# EAGLE design Adafruit OV5640 Breakout (EAGLE 9.6.2)
COMPANY: ADAFRUIT INDUSTRIES; DRAWN: KTOWN; REV: A
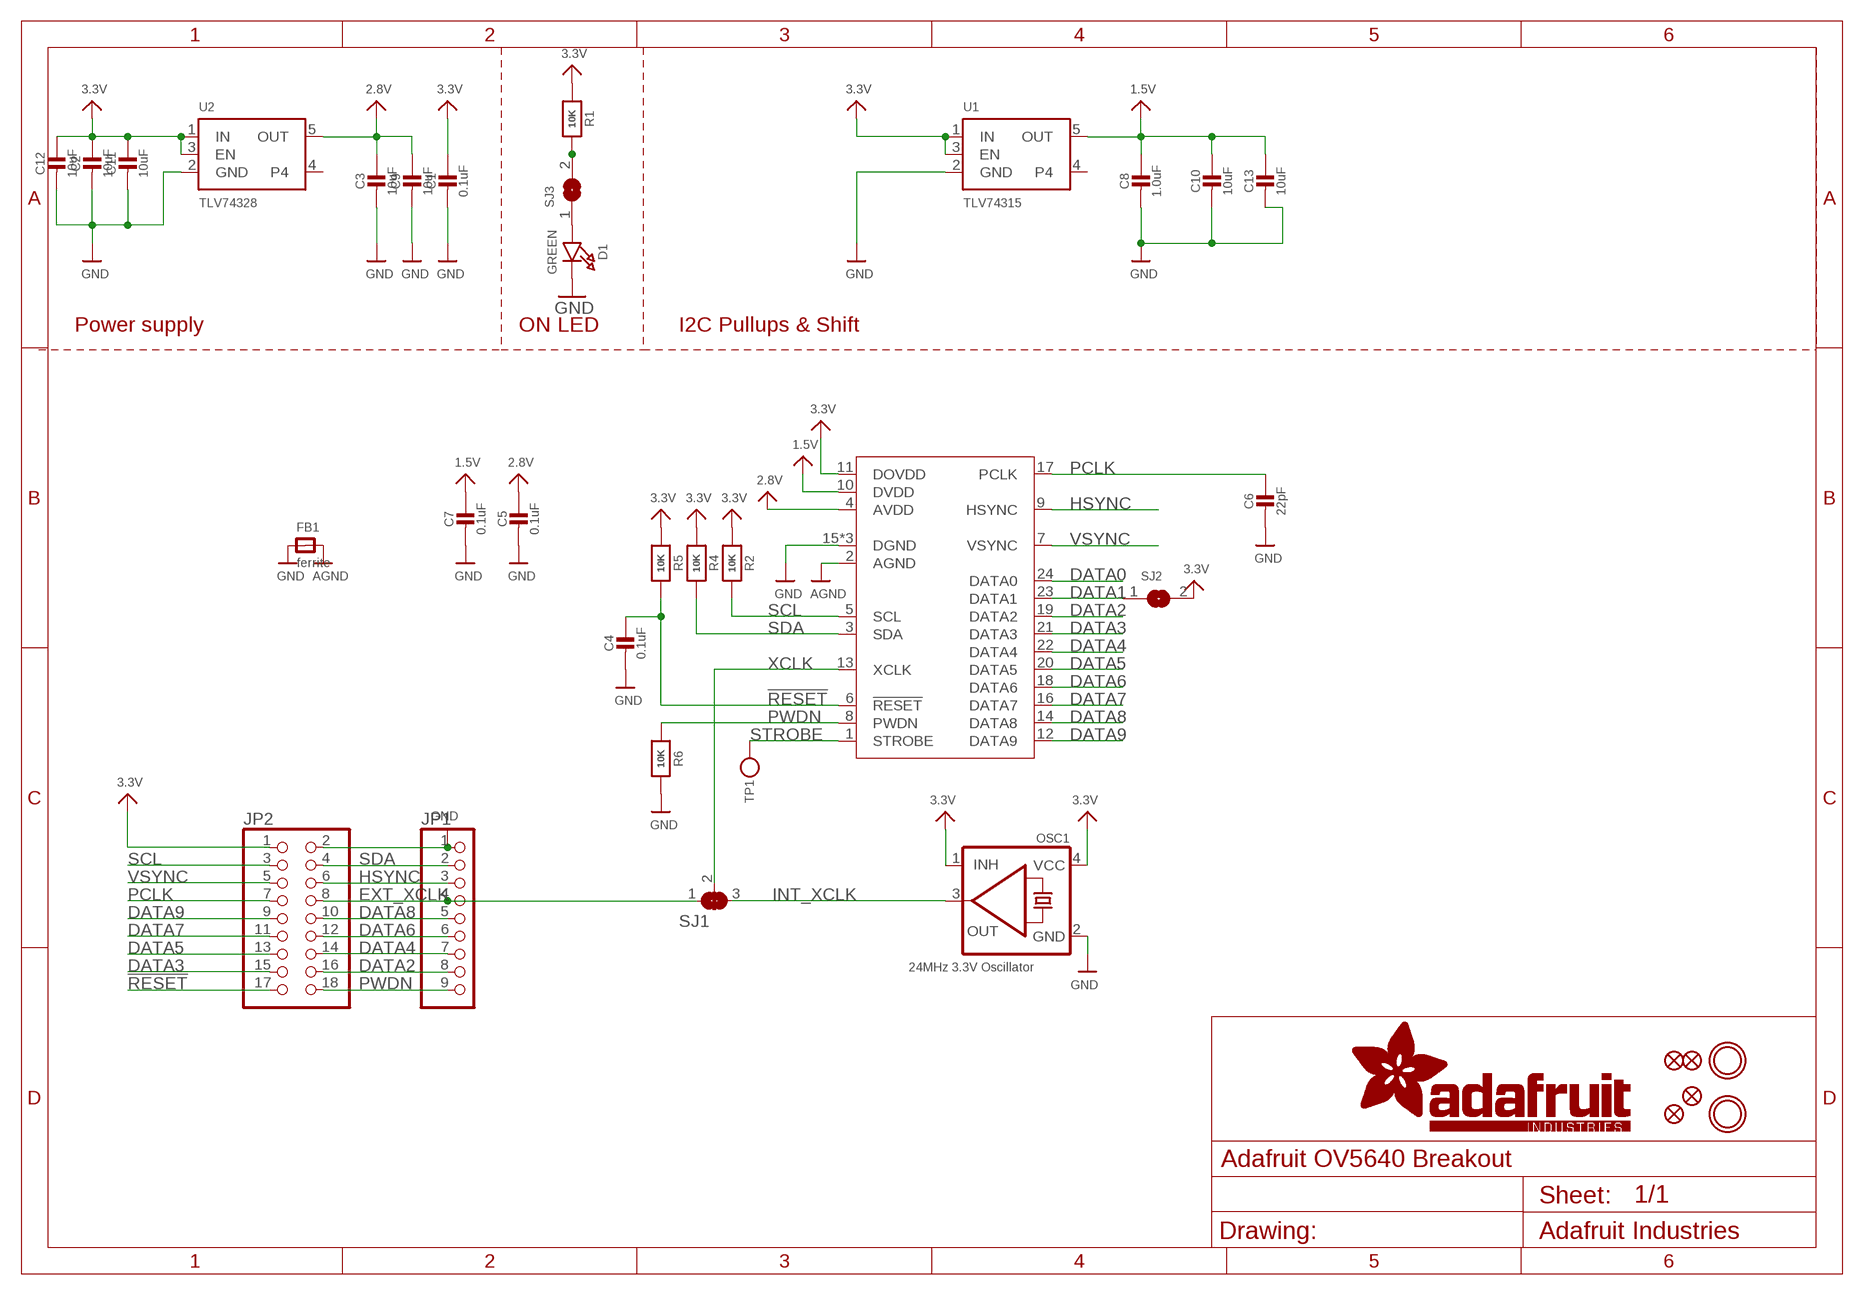
[diagram p0: schematic, sheet 1]

## Parts
C1  0.1uF  CAP_CERAMIC0603_NO  [0603-NO]
C2  10uF  CAP_CERAMIC0805-NOOUTLINE  [0805-NO]
C3  10uF  CAP_CERAMIC0805-NOOUTLINE  [0805-NO]
C4  0.1uF  CAP_CERAMIC0603_NO  [0603-NO]
C5  0.1uF  CAP_CERAMIC0603_NO  [0603-NO]
C6  22pF  CAP_CERAMIC0603_NO  [0603-NO]
C7  0.1uF  CAP_CERAMIC0603_NO  [0603-NO]
C8  1.0uF  CAP_CERAMIC0603_NO  [0603-NO]
C9  10uF  CAP_CERAMIC0805-NOOUTLINE  [0805-NO]
C10  10uF  CAP_CERAMIC0805-NOOUTLINE  [0805-NO]
C11  10uF  CAP_CERAMIC0805-NOOUTLINE  [0805-NO]
C12  10uF  CAP_CERAMIC0805-NOOUTLINE  [0805-NO]
C13  10uF  CAP_CERAMIC0805-NOOUTLINE  [0805-NO]
D1  GREEN  LED0603_NOOUTLINE  [CHIPLED_0603_NOOUTLINE]
FB1  ferrite  FERRITE-0603NO  [0603-NO]
FID1  FIDUCIAL_1MM  [FIDUCIAL_1MM]
FID2  FIDUCIAL_1MM  [FIDUCIAL_1MM]
FID3  FIDUCIAL_1MM  [FIDUCIAL_1MM]
FID4  FIDUCIAL_1MM  [FIDUCIAL_1MM]
JP1  HEADER-1X970MIL  [1X09_ROUND_70]
JP2  PINHD-2X9-BIG  [2X09-BIG]
OSC1  24MHz 3.3V Oscillator  OSCILLATOR3.2X2.5  [OSC_3.2X2.5MM]
R1  10K  RESISTOR_0603_NOOUT  [0603-NO]
R2  10K  RESISTOR_0603_NOOUT  [0603-NO]
R4  10K  RESISTOR_0603_NOOUT  [0603-NO]
R5  10K  RESISTOR_0603_NOOUT  [0603-NO]
R6  10K  RESISTOR_0603_NOOUT  [0603-NO]
SJ1  SOLDERJUMPER_2WAY  [SOLDERJUMPER_2WAY_OPEN_NOPASTE]
SJ2  SOLDERJUMPER  [SOLDERJUMPER_ARROW_NOPASTE]
SJ3  SOLDERJUMPERCLOSED  [SOLDERJUMPER_CLOSEDWIRE]
TP1  TESTPOINTROUND1.5MM  [TESTPOINT_ROUND_1.5MM]
U1  TLV74315  VREG_SOT23-5  [SOT23-5]
U2  TLV74328  VREG_SOT23-5  [SOT23-5]
U$1  MOUNTINGHOLE3.0THIN  [MOUNTINGHOLE_3.0_PLATEDTHIN]
U$17  MOUNTINGHOLE3.0THIN  [MOUNTINGHOLE_3.0_PLATEDTHIN]
X1  CAMERA_OV2640  [OV2640FSL]

## Nets
1.5V: C7.1 C8.1 C10.1 C13.1 U1.5(OUT) X1.10(DVDD)
2.8V: C3.1 C5.1 C9.1 U2.5(OUT) X1.4(AVDD)
3.3V [lowpower]: C1.1 C2.1 C11.1 C12.1 JP2.1 OSC1.1(INH) OSC1.4(VCC) R1.1 R2.1 R4.1 R5.1 SJ2.2 U1.1(IN) U1.3(EN) U2.1(IN) U2.3(EN) X1.11(DOVDD)
!RESET: C4.1 JP2.17 R5.2 X1.6(!RESET)
AGND: FB1.2 X1.2(AGND)
DATA0: X1.24(DATA0)
DATA1: SJ2.1 X1.23(DATA1)
DATA2: JP1.8 JP2.16 X1.19(DATA2)
DATA3: JP2.15 X1.21(DATA3)
DATA4: JP1.7 JP2.14 X1.22(DATA4)
DATA5: JP2.13 X1.20(DATA5)
DATA6: JP1.6 JP2.12 X1.18(DATA6)
DATA7: JP2.11 X1.16(DATA7)
DATA8: JP1.5 JP2.10 X1.14(DATA8)
DATA9: JP2.9 X1.12(DATA9)
EXT_XCLK: JP1.4 JP2.8 SJ1.1
GND [highpower]: C1.2 C2.2 C3.2 C4.2 C5.2 C6.2 C7.2 C8.2 C9.2 C10.2 C11.2 C12.2 C13.2 D1.C FB1.1 JP1.1 JP2.2 OSC1.2(GND) R6.2 U1.2(GND) U2.2(GND) X1.15(DGND) X1.SPRT1(DGND) X1.SPRT2(DGND)
HSYNC: JP1.3 JP2.6 X1.9(HSYNC)
INT_XCLK: OSC1.3(OUT) SJ1.3
N$1: R1.2 SJ3.2
N$3: D1.A SJ3.1
PCLK: C6.1 JP2.7 X1.17(PCLK)
PWDN: JP1.9 JP2.18 R6.1 X1.8(PWDN)
SCL: JP2.3 R2.2 X1.5(SCL)
SDA: JP1.2 JP2.4 R4.2 X1.3(SDA)
STROBE: TP1.P$1 X1.1(STROBE)
VSYNC: JP2.5 X1.7(VSYNC)
XCLK: SJ1.2 X1.13(XCLK)
Unconnected: U1.4 U2.4

## Notes on the sheet
- Power supply | ON LED | I2C Pullups & Shift

## Library data of the parts
C1-C13 = microbuilder:CAP_CERAMIC: Ceramic Capacitors For new designs, use the packages preceded by an '_' character since they are more reliable: The following footprints should be used on most boards: _0402 - Standard footprint for regular board layouts _0603 - Standard footprint for regular board layouts _0805 - Standard footprint for regular board layouts _1206 - Standard footprint for regular board layouts For extremely tight-pitch boards where space is at a premium, the following 'micro-pitch' footprints can be used (smaller pads, no silkscreen outline, etc.): _0402MP - Micro-pitch footprint for very dense/compact boards _0603MP - Micro-pitch footprint for very dense/compact boards _0805MP - Micro-pitch footprint for very dense/compact boards _1206MP - Micro-pitch footprint for very dense/compact boards
D1 = microbuilder:LED: LED 0603 - 0603 Surface Mount Package 2mA: Green LED - Low Power (3.9mcd, 2ma, 1.7Vf) - Digikey: 475-2709-2-ND Orange LED - Low Power (9.8mcd, 2ma, 1.8Vf) - Digikey: 475-1194-2-ND Red LED - Low Power (5mcd, 2ma, 1.8Vf) - Digikey: 475-1195-2-ND Yellow LED - Low Power (7mcd, 2ma, 1.8Vf) - Digikey: 475-1196-2-ND 5mA: Blue LED - Low Power (17mcd, 5ma, 2.9Vf) - Digikey: LNJ937W8CRACT-ND 0805 - 0805 Surface Mount Package 2mA: Red LED (8.8mcd, 2mA, 1.8Vf, Clear) - Low Power [Digikey: 475-2510-1-ND] Green LED (5mcd, 2mA, 1.8Vf, Clear) - Low Power [Digikey: 475-2730-1-ND] Yellow LED (11.3mcd, 2mA, 1.8Vf, Clear) - Low Power [Digikey: 475-2555-1-ND] 20mA: Red LED (104mcd, 20mA, Diffused) - LS R976 [Digikey: 475-1278-6-ND] Red LED (12mcd, 20mA, 2.0Vf, Clear) - APT2012EC [Digikey: 754-1128-1-ND] Green LED (15mcd, 20mA, 2.2Vf, Clear) - APT2012GC [Digikey: 754-1131-1-ND] Orange LED (160mcd, 20mA, 2.1Vf, Clear) - APT2012SECK [Digikey: 754-1130-1-ND] 1206 - 1206 Surface Mount Package Green LED (26mcd, 20mA, Diffused) - LG N971 [Digikey: 475-1407-6-ND] Red LED (15mcd, 20mA, Diffused) - LH N974 [Digikey: 475-1416-6-ND] Cree - Cree High-Power Surface Mount LEDs XPEBWT-L1-0000-00D50 - White 111lm 350mA 2.9Vf 6200K 110° XTEAWT-00-0000-00000LEE3 - White 114lm 350mA 2.85Vf 5000K 115° Everlight - Everlight 45-21 Series Surface Mount LEDs 45-21/QK2C-B2832AC2CB2/2T - Warm White 2000mcd 20mA 3.25Vf 3050K 120° 45-21/LK2C-B38452C4CB2/2T - Nuetral White 2000mcd 20mA 3.25Vf 4150K 120° 45-21/LK2C-B50634C6CB2/2T - Cold White 2200mcd 20mA 3.25Vf 5650K 120° PLCC2 Reverse Mount LS T77K-J1L2-1-0-2-R18-Z - Red 11.25mcd 2mA 1.8Vf 630nm 120° LO T77K-L1M2-24-Z - Orange 19.6mcd 2mA 1.8Vf 606nm 120° LY T77K-K2M1-26-Z - Yellow 15.7mcd 2mA 1.8Vf 587nm 120°; ROT: 270
FB1 = microbuilder:FERRITE: Ferrite Bead 0603 MMZ1608B121C - 120 Ohm @ 100MHz, 600mA, 0.15 Ohm DC Resistance - Digikey: 445-2164-1-ND BK1608HW121-T - 120 Ohm, 600mA Ferrite Chip - Digikey: 587-1876-2-ND 0805 HZ0805B272R-10 - 2.7K Ohm @ 100MHz, 200mA, 0.8 Ohm DC Resistance - Digikey: 240-2504-1-ND (see also Murata BLM21BD272SN1L) MMZ2012Y152B - 1.5K Ohm @ 100MHz, 500mA, 0.4 Ohm DC Resistance - Digikey: 445-1560-1-ND - Mainly for high frequency (80-400MHz) MMZ2012R102A - 1K Ohm @ 100MHz, 500mA, 0.3 Ohm DC Resistance - Digikey: 445-1555-2-ND - More general purpose (10-200MHz)
FID1-FID4 = microbuilder:FIDUCIAL: Fiducial Alignment Points Various fiducial points for machine vision alignment.; BOM: EXCLUDE
JP1 = microbuilder:HEADER-1X9: PIN HEADER
JP2 = adafruit:PINHD-2X9: PIN HEADER With larger annulars
OSC1 = microbuilder:OSCILLATOR: Oscillators 3.2x2.5mm SMT 4.0MHz +/- 50ppm, 3.3V, 9mA, -40/+85°C - Digikey: 535-9752-1-ND 50MHz +/- 50ppm, 3.3V, 8mA, -10/+70°C - Digikey: 478-4792-1-ND 5x7mm SMT 4.0MHz +/-20ppm 3.3V, 20mA, -20/+70°C - Digikey: 535-9329-2-ND 50MHz +/- 25ppm 3.3V, 35mA, -40/+85°C - Digikey: 631-1197-1-ND
R1 R2 R4-R6 = microbuilder:RESISTOR: Resistors For new designs, use the packages preceded by an '_' character since they are more reliable: The following footprints should be used on most boards: _0402 - Standard footprint for regular board layouts _0603 - Standard footprint for regular board layouts _0805 - Standard footprint for regular board layouts _1206 - Standard footprint for regular board layouts For extremely tight-pitch boards where space is at a premium, the following 'micro-pitch' footprints can be used (smaller pads, no silkscreen outline, etc.): _0402MP - Micro-pitch footprint for very dense/compact boards _0603MP - Micro-pitch footprint for very dense/compact boards _0805MP - Micro-pitch footprint for very dense/compact boards _1206MP - Micro-pitch footprint for very dense/compact boards
SJ1 = microbuilder:SOLDERJUMPER_2WAY: 2-Way Solder Jumper
SJ2 = microbuilder:SOLDERJUMPER: SMD Solder JUMPER Solder the two pads together to create a connection, or remove the solder to break it. REFLOW - Use this footprint for solder paste and reflow ovens. WAVE - Use this footprint for hand-soldering (larger pads). CLOSED - Has a trace between the two pads to ensure it is closed by default. The trace needs to be cut to disable the jumper, and can be closed again by creating a solder bridge between the two pads.; BOM: EXCLUDE
SJ3 = microbuilder:SOLDERJUMPER: SMD Solder JUMPER Solder the two pads together to create a connection, or remove the solder to break it. REFLOW - Use this footprint for solder paste and reflow ovens. WAVE - Use this footprint for hand-soldering (larger pads). CLOSED - Has a trace between the two pads to ensure it is closed by default. The trace needs to be cut to disable the jumper, and can be closed again by creating a solder bridge between the two pads.
TP1 = microbuilder:TESTPOINT: Test Point Various test points for characterisation and PCB testing TESTPOINT_SMT - Compact Surface Mount Test Point [Digikey: 5016KTR-ND]
U1 U2 = adafruit_power:VREG_SOT23-5: SOT23-5 Fixed Voltage Regulators Part Current Out V Out V In V Dropout θJA (°C/W) TJ (°C) Digikey Part No. ADP121 150mA 3.3V 3.4-5.5V 0.09V @ 150mA -- -- ADP121-AUJZ33R7CT-ND ADP121 150mA 3.0V 3.1-5.5V 0.09V @ 150mA -- -- ADP121-AUJZ30R7CT-ND ADP122 300mA 3.3V 3.4-5.5V 0.085V @ 300mA -- -- ADP122AUJZ-3.3-R7CT-ND ADP1712 300mA 3.3V 3.5-5.5V 0.17V @ 300mA -- -- ADP1712AUJZ-3.3-R7TR-ND AP7311 (Low Cost) 150mA 3.3V 3.5-6V 0.15V @ 150mA -- -- AP7311-33WG-7DICT-ND LD39015M18R 150mA 1.8V 1.9V-5.5V 0.08V @ 100mA -- -- 497-6977-1-ND LP2985A-33DBVR 150mA 3.3V 3.3-16V 0.28V @ 150mA 206 150 296-18479-1-ND MCP1824T-3302E/OT 300mA 3.3V 3.5V-6V 0.2V @ 300mA -- -- MCP1824T-3302E/OTCT-ND MIC5205-2.5YM5 TR 150mA 2.5V 2.7-16V 0.165V @ 150mA -- -- 576-1257-2-ND MIC5205-3.0YM5 TR 150mA 3.0V 3.2V-16V 0.165V @ 150mA -- -- 576-1258-2-ND MIC5205-3.3YM5 TR 150mA 3.3V 3.5V-16V 0.165V @ 150mA -- -- 576-1259-2-ND TPS780330220 150mA 3.3V+2.2V 3.6-5.5V 250mV Max -- -- 296-23332-1-ND TDA3663/N1,135 100mA 3.3V 3.5-45V 0.18V @ 50mA -- -- 568-5343-1-ND Max operating temp can be calculated using θJA, TJ (max junction temperature), and power in watts. Set the "Maximum Ambient Temperature" until it reaches TJ ("Max Junction Temperature"), which is the absolute limit for safe use of the regulator: Heat Sink Temperature Calculator <http://www.daycounter.com/Calculators/Heat-Sink-Temperature-Calculator.phtml> For example, With 12V source into a 3.3V LP2985 and a 30mA load, we are dissipating (12V-3.3V) * 0.03A = 0.261W. With a θJA of 206 °C/W, a TJ of 150°C, and 261mW we can safely use the chip without a heat sink up to 75°C (=147.1°C Junction Temperature).; JLC_ROTATION: 0
U$1 U$17 = adafruit_electromech:MOUNTINGHOLE: Mounting Hole For #2 screws (0.086"/2.18mm width, 0.094"/2.4mm hole) use 2.5mm; BOM: EXCLUDE
X1 = adafruit_sensor:CAMERA_OV2640

## Net classes
1 highpower: width 0.305 mm, drill 0.483 mm
2 lowpower: width 0.254 mm, drill 0.483 mm

## Board
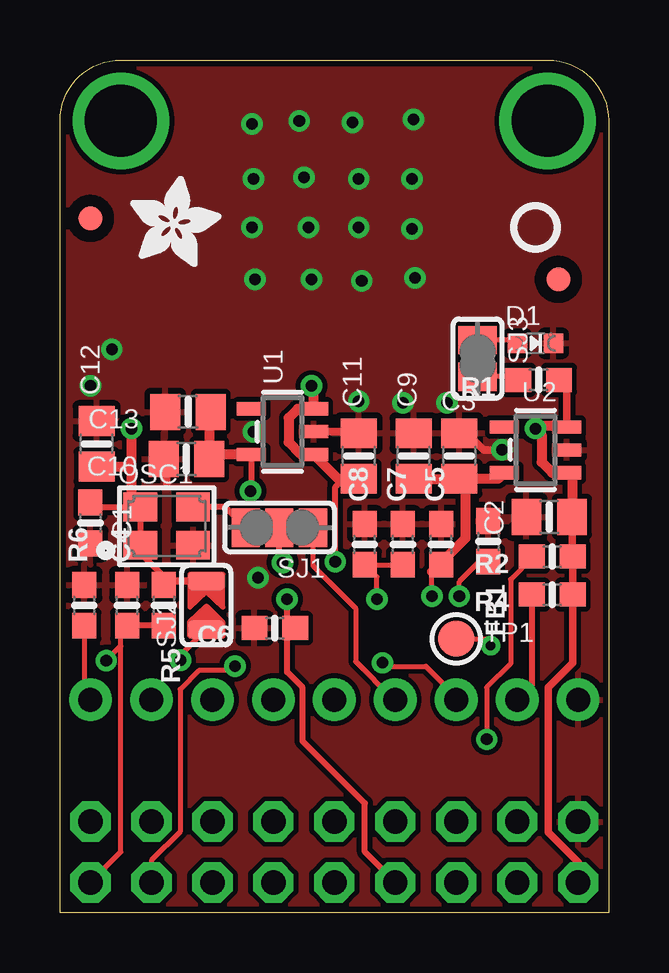
[diagram p1: board, top side]
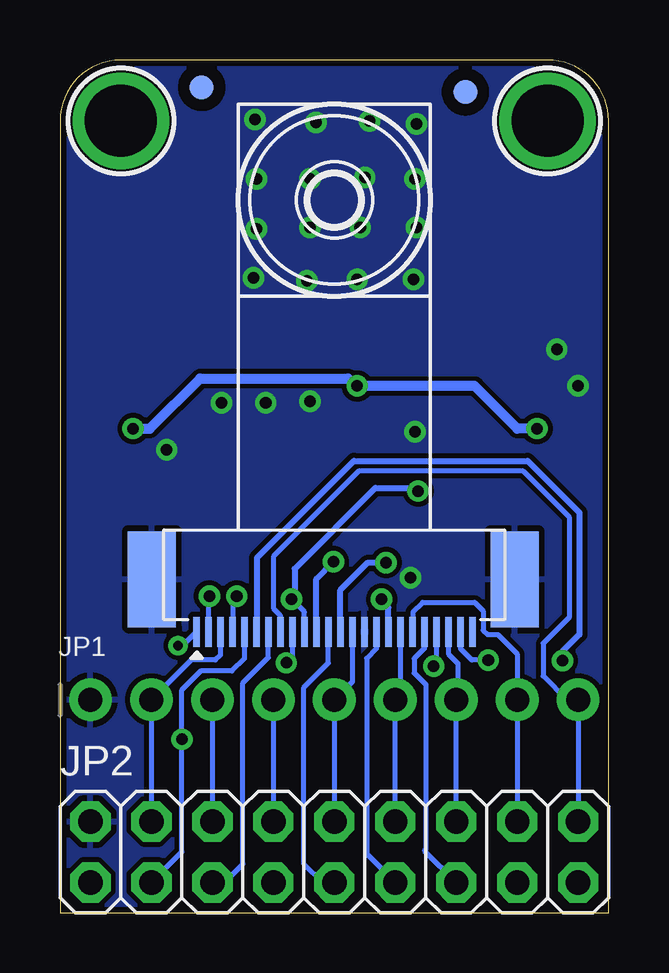
[diagram p2: board, bottom side, seen from below]

Size 22.86 x 35.56 mm. Coordinates in mm from the lower left corner, seen from the top.
Outline: 0,0 0,33.02 arc-90 2.54,35.56 20.32,35.56 arc-90 22.86,33.02 22.86,0 0,0
Copper layers (1*16): Top 0.035mm / dielectric 1.5mm / Bottom 0.035mm
Design rules "adafruit *": minimum track width 8mil, minimum drill 15.5mil, track to track 8mil, track to pad 8mil, pad to pad 8mil, via to via 8mil, smd to smd 8mil, copper to edge 10mil, drill to drill 8mil, minimum pad ring 10mil, minimum via ring 8mil, stop-mask expansion 2mil, vias tented up to drill 20mil, thermal gap 10mil

### Footprints (pad centres in the part's own frame; a part is rotated, then mirrored left to right if it is on the bottom)
0603-NO = smd 1.075 x 1: 1 -0.85,0; 2 0.85,0
0805-NO = smd 1.24 x 1.5: 1 -0.95,0; 2 0.95,0
CHIPLED_0603_NOOUTLINE = smd 0.8 x 0.8: A 0,-0.75; C 0,0.75
FIDUCIAL_1MM = smd 1 x 1: 1 0,0
1X09_ROUND_70 = drill 1 pad 1.778: 1 -10.16,0; 2 -7.62,0; 3 -5.08,0; 4 -2.54,0; 5 0,0; 6 2.54,0; 7 5.08,0; 8 7.62,0; 9 10.16,0
2X09-BIG = drill 1.016 pad 1.676 octagon: 1 -10.16,-1.27; 2 -10.16,1.27; 3 -7.62,-1.27; 4 -7.62,1.27; 5 -5.08,-1.27; 6 -5.08,1.27; 7 -2.54,-1.27; 8 -2.54,1.27; 9 0,-1.27; 10 0,1.27; 11 2.54,-1.27; 12 2.54,1.27; 13 5.08,-1.27; 14 5.08,1.27; 15 7.62,-1.27; 16 7.62,1.27; 17 10.16,-1.27; 18 10.16,1.27
OSC_3.2X2.5MM = smd 1.4 x 1.2: 1 -1.1,-0.8; 2 1.1,-0.8; 3 1.1,0.8; 4 -1.1,0.8
SOLDERJUMPER_2WAY_OPEN_NOPASTE = smd 1.168 x 1.6: 1 -1.397,0; 2 0,0; 3 1.397,0
SOLDERJUMPER_ARROW_NOPASTE = smd 0.762 x 1.524: 1 -1.016,0; 2 1.016,0
SOLDERJUMPER_CLOSEDWIRE = smd 1.168 x 1.6: 1 -0.762,0; 2 0.762,0 | smd 0.635 x 0.203: WIRE 0,0
TESTPOINT_ROUND_1.5MM = smd 1.5 x 1.5: P$1 0,0
SOT23-5 = smd 0.55 x 1.2: 1 -0.95,-1.3; 2 0,-1.3; 3 0.95,-1.3; 4 0.95,1.3; 5 -0.95,1.3
MOUNTINGHOLE_3.0_PLATEDTHIN = drill 3 pad 3.6: P$1 0,0
OV2640FSL = smd 0.275 x 1.25: 1 5.75,0.98; 2 5.25,0.98; 3 4.75,0.98; 4 4.25,0.98; 5 3.75,0.98; 6 3.25,0.98; 7 2.75,0.98; 8 2.25,0.98; 9 1.75,0.98; 10 1.25,0.98; 11 0.75,0.98; 12 0.25,0.98; 13 -0.25,0.98; 14 -0.75,0.98; 15 -1.25,0.98; 16 -1.75,0.98; 17 -2.25,0.98; 18 -2.75,0.98; 19 -3.25,0.98; 20 -3.75,0.98; 21 -4.25,0.98; 22 -4.75,0.98; 23 -5.25,0.98; 24 -5.75,0.98 | smd 2 x 4: SPRT1 7.6,-1.21; SPRT2 -7.51,-1.21

### Placement (x,y rotation side)
C1  1.27,16.26 270 top
C2  20.38,16.51 180 top
C3  16.64,19.05 90 top
C4  2.79,12.83 90 top
C5  15.88,15.37 90 top
C6  8.95,11.87 180 top
C7  14.29,15.37 90 top
C8  12.7,15.37 90 top
C9  14.73,19.05 90 top
C10  5.27,18.92 180 top
C11  12.45,19.05 90 top
C12  1.52,19.56 90 top
C13  5.33,20.89 180 top
D1  19.81,23.75 270 top
FB1  17.84,15.49 270 top
FID1  1.27,28.96 0 top
FID2  20.76,26.42 0 top
FID3  16.95,34.42 0 bottom
FID4  5.97,34.23 0 bottom
JP1  11.43,8.89 0 bottom
JP2  11.43,2.54 0 bottom
OSC1  4.45,16.13 0 top
PLABEL0  [PLABEL0]  18.99,24.38 0 top
PLABEL1  [PLABEL1]  10.48,13.78 90 top
PLABEL2  [PLABEL2]  7.87,13.91 90 top
PLABEL3  [PLABEL3]  9.14,17.72 0 top
PLABEL4  [PLABEL4]  6.16,10.48 0 top
PLABEL5  [PLABEL5]  16.07,21.78 90 top
PLABEL6  [PLABEL6]  19.68,22.92 90 bottom
PLABEL7  [PLABEL7]  3.68,23.37 90 bottom
PLABEL8  [PLABEL8]  1.08,7.24 0 bottom
PLABEL9  [PLABEL9]  3.68,7.37 0 bottom
PLABEL10  [PLABEL10]  6.22,7.37 0 bottom
PLABEL11  [PLABEL11]  8.76,7.37 0 bottom
PLABEL12  [PLABEL12]  11.3,7.37 0 bottom
PLABEL13  [PLABEL13]  13.84,7.37 0 bottom
PLABEL14  [PLABEL14]  16.38,7.37 0 bottom
PLABEL15  [PLABEL15]  18.92,7.37 0 bottom
PLABEL16  [PLABEL16]  21.46,7.37 0 bottom
PLABEL17  [PLABEL17]  21.46,5.84 0 bottom
PLABEL18  [PLABEL18]  18.92,5.84 0 bottom
PLABEL19  [PLABEL19]  16.38,5.84 0 bottom
PLABEL20  [PLABEL20]  13.84,5.84 0 bottom
PLABEL21  [PLABEL21]  11.3,5.84 0 bottom
PLABEL22  [PLABEL22]  8.76,5.84 0 bottom
PLABEL23  [PLABEL23]  6.22,5.84 0 bottom
PLABEL24  [PLABEL24]  3.68,5.84 0 bottom
PLABEL25  [PLABEL25]  1.14,5.84 0 bottom
R1  19.94,22.23 180 top
R2  20.51,14.86 180 top
R4  20.51,13.27 180 top
R5  4.32,12.83 270 top
R6  1.02,12.83 90 top
SJ1  9.14,16.07 180 top
SJ2  6.1,12.83 90 top
SJ3  17.4,23.11 270 top
TP1  16.51,11.43 0 top
U1  9.27,20.07 90 top
U2  19.81,19.3 90 top
U$1  20.32,33.02 0 bottom
U$17  2.54,33.02 0 bottom
U$22  [ADAFRUIT_3.5MM]  2.92,26.92 0 top
U$25  [PCBFEAT-REV-040]  19.81,28.57 0 top
X1  11.43,12.7 180 bottom

### Tracks (layer width: path | path; a pad name or v marks a point on that pad's centre or on a via)
1.5V  (via drill 0.48)
  Top 0.203: v13.21,13.08 13.21,14.01 C8.1 C7.1
  Top 0.254: U1.5 7.97,17.62 v7.94,17.59
  Top 0.406: C13.1 6.22,20.83 C10.1 6.41,19.12 U1.5
  Bottom 0.203: X1.10 12.68,12.55 12.67,12.55 v13.21,13.08
  Bottom 0.254: v7.94,17.59 8.06,17.72 9.72,17.72 13.08,14.35 13.08,13.21 v13.21,13.08
2.8V  (via drill 0.48)
  Top 0.203: v15.49,13.21 15.49,14.22 | C5.1 15.88,14.61 16,14.73
  Top 0.406: C9.1 C3.1 | U2.5 18.26,18.1 C3.1 | C3.1 16.89,17.85 16.89,15.62 16,14.73 15.49,14.22
  Bottom 0.203: X1.4 15.66,11.74 15.66,13.04 v15.49,13.21
3.3V  (via drill 0.48)
  Top 0.254: C1.1 1.45,16.93 OSC1.4 OSC1.1 3.35,15.01 4.32,14.03 R5.1 | v11.47,14.64 11.47,17.76 11.81,18.1
  Top 0.305: JP2.1 21.59,2.12 20.34,3.37 20.34,9.41 21.36,10.42 R4.1 R2.1 21.33,14.89 C2.1 | R1.1 21.11,21.9 21.11,20.32 U2.3 | R5.1 4.48,13.84 SJ2.2
  Top 0.406: C11.1 11.81,18.1 11.59,18.1 U1.1 10.03,19.12 9.53,19.62 9.53,20.64 9.9,21.02 U1.3 10.57,21.88 v10.48,21.97 | 21.11,20.32 19.94,20.32 v19.81,20.19 20.07,19.94 20.07,18.8 20.51,18.35 U2.1 21.33,18.13 C2.1 | OSC1.4 3.35,17.1 2.98,17.46 2.98,18.73 | 2.98,18.73 v2.98,20.19 | C12.1 2.86,18.61 2.98,18.73
  Bottom 0.254: X1.11 12.18,13.94 v11.47,14.64
  Bottom 0.406: v19.81,20.19 19.11,20.19 17.02,22.29 10.86,22.29 10.51,21.94 v10.48,21.97 5.59,21.97 3.81,20.19 v2.98,20.19
!RESET  (via drill 0.48)
  Top 0.203: JP2.17 2.54,2.54 2.54,11.13 | C4.1 2.54,11.72 2.54,11.13 | v1.93,10.52 2.54,11.13
  Top 0.254: R5.2 C4.1
  Bottom 0.254: X1.6 14.65,11.72 14.65,14.81 10.62,18.85 3.38,18.85 1.22,16.69 1.22,11.61 1.93,10.9 v1.93,10.52
AGND  (via drill 0.48)
  Top 0.203: v16.64,13.21 16.64,13.82 17.46,14.64 FB1.2
  Bottom 0.203: X1.2 16.67,13.17 v16.64,13.21
DATA1  (via drill 0.48)
  Top 0.203: SJ2.1 5.02,10.73 v5.02,10.54
  Bottom 0.203: X1.23 6.18,11.02 5.7,10.54 v5.02,10.54
DATA2
  Bottom 0.203: X1.19 8.15,11.74 8.15,12.55 7.75,12.95 5.59,12.95 5.22,12.59 5.22,11.78 5.05,11.61 4.62,11.61 3.81,10.79 JP1.8 JP2.16
DATA3  (via drill 0.48)
  Top 0.203: v7.29,10.29 7.1,10.1 5.79,10.1 5,9.32 5,3.39 3.81,2.19 JP2.15
  Bottom 0.203: X1.21 7.18,10.4 v7.29,10.29
DATA4
  Bottom 0.203: X1.22 6.68,10.81 6.29,10.41 6.29,8.95 JP1.7 JP2.14
DATA5
  Bottom 0.203: JP2.13 7.68,2.6 7.62,2.66 7.62,9.53 8.1,10.01 8.1,10.6 7.68,11.03 X1.20
DATA6
  Bottom 0.203: X1.18 8.68,9.1 JP1.6 JP2.12
DATA7
  Bottom 0.203: X1.16 9.68,11.02 10.08,10.62 10.08,2.46 JP2.11
DATA8
  Bottom 0.203: X1.14 10.68,9.64 JP1.5 JP2.10
DATA9
  Bottom 0.203: JP2.9 11.94,1.27 12.7,2.03 12.7,9.4 11.68,10.42 X1.12
EXT_XCLK
  Top 0.203: SJ1.1 10.54,14.48 12.32,12.7 12.32,10.48 13.91,8.89 JP1.4
  Bottom 0.203: JP1.4 JP2.8
GND  (via drill 0.48)
  Top 0.305: C11.2 12.38,20.07 U1.2 | C10.2 4.45,18.8 4.45,17.78 | C3.2 16.96,20 17.65,19.3 v18.41,19.3
  other vias: 2.16,23.5 8.26,13.97 1.27,21.97 12.45,21.34 14.29,21.27 16.13,21.27 8.06,20.07 8.13,26.42 10.48,26.42 12.57,26.35 14.8,26.48 14.67,28.51 14.67,30.61 14.73,33.08 12.19,32.96 12.45,30.61 12.45,28.57 10.35,28.57 10.16,30.67 9.97,33.02 8,32.89 8.06,30.61 8,28.57
  pour Bottom: 22.86,35.56 0,35.56 0,0 22.86,0
  pour Top: 22.86,35.56 0,35.56 0,0 22.86,0
HSYNC  (via drill 0.48)
  Top 0.203: v13.43,10.43 13.57,10.29 15.24,10.29 16.51,9.02 JP1.3
  Bottom 0.203: JP1.3 JP2.6 | X1.9 13.18,10.68 v13.43,10.43
INT_XCLK
  Top 0.254: SJ1.3 6.88,16.93 OSC1.3
N$1
  Top 0.203: R1.2 18.96,22.35 SJ3.2
N$2
  Top 0.203: 10.1,16 9.65,16
N$3
  Top 0.203: D1.A 18.93,23.88 SJ3.1
PCLK  (via drill 0.48)
  Top 0.203: C6.1 9.46,11.87
  Top 0.254: JP2.7 12.7,2.54 12.7,4.57 10.11,7.16 10.11,9.39 9.46,10.04 9.46,11.87 v9.46,13.08
  Bottom 0.254: X1.17 9.18,12.74 9.46,13.02 v9.46,13.08
PWDN
  Top 0.203: R6.1 1.02,9.14 JP1.9
  Bottom 0.203: JP2.18 JP1.9 1.74,8.89 2.73,9.88 2.73,11.24 1.65,12.32 1.65,16.51 3.56,18.41 10.41,18.41 13.97,14.86 13.97,12.7 13.74,12.47 13.69,12.42 X1.8
SCL  (via drill 0.48)
  Top 0.203: v17.78,7.24 17.78,9.4 18.77,10.39 18.77,13.91 19.66,14.8 R2.2
  Bottom 0.203: JP2.3 17.78,2.54 v17.78,7.24 17.78,9.31 17,10.08 15.7,10.08 15.18,10.6 X1.5
SDA
  Top 0.254: R4.2 19.66,9.5 JP1.2
  Bottom 0.203: X1.3 16.18,10.74 16.38,10.54 17.4,10.54 JP1.2 JP2.4
STROBE  (via drill 0.39)
  Top 0.203: v17.94,11.15 17.94,11.27 17.79,11.43 TP1.P$1
  Bottom 0.203: v17.94,11.15 17.75,11.15 X1.1
VSYNC
  Bottom 0.203: JP2.5 16,1.27 15.24,2.03 15.24,9.59 14.18,10.64 X1.7
XCLK  (via drill 0.48)
  Top 0.254: v9.27,14.61 9.14,14.73 SJ1.2
  Bottom 0.254: X1.13 11.18,13.46 10.03,14.61 v9.27,14.61

### Text on the board
Pinguin_tBackup: on | LED | XCLK | Int | Ext | VM
Pinguin_bBackup: Camera / Module | adafruit / OV5640 | PD | D2 | D4 | D6 | D8 | XC | HS | SDA | G | RT | D3 | D5 | D7 | D9 | PC | VS | SCL | 3V